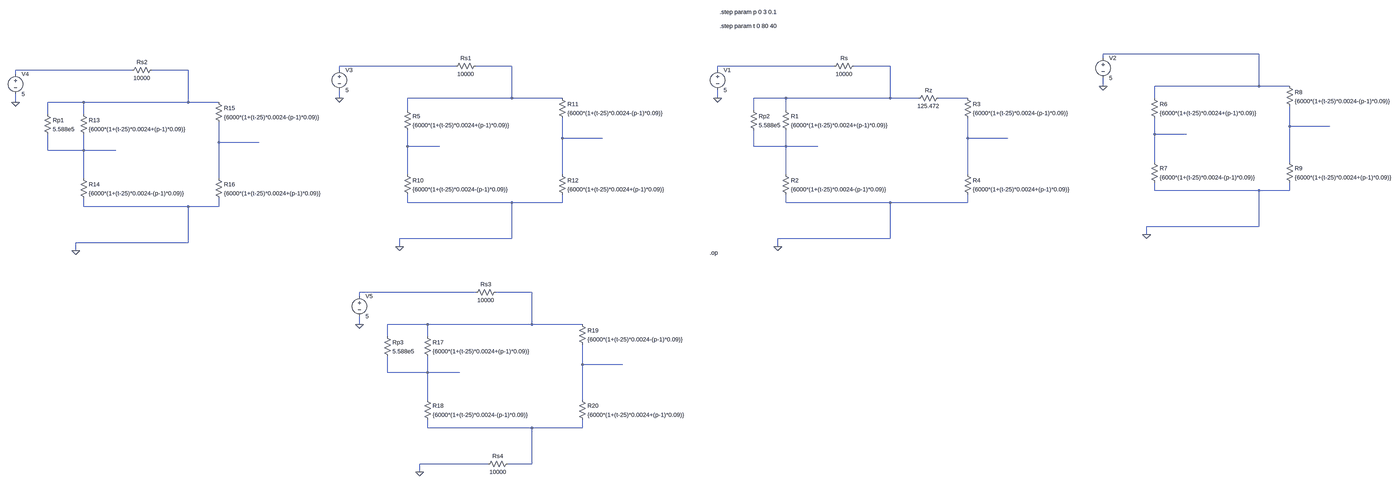
[diagram p0: schematic sims.asc, whole sheet]
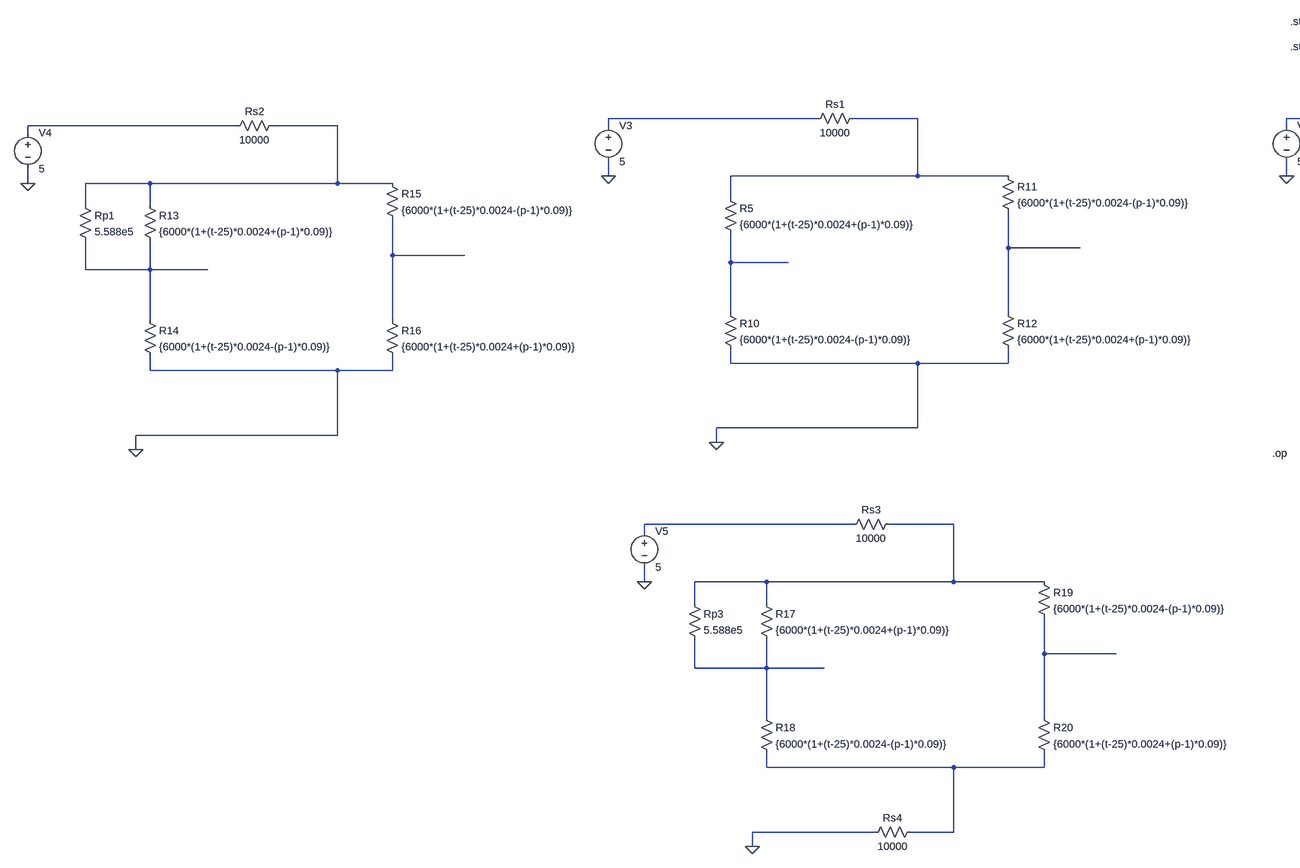
[diagram p1: schematic sims.asc, part, row 1 of 1, column 1 of 2]
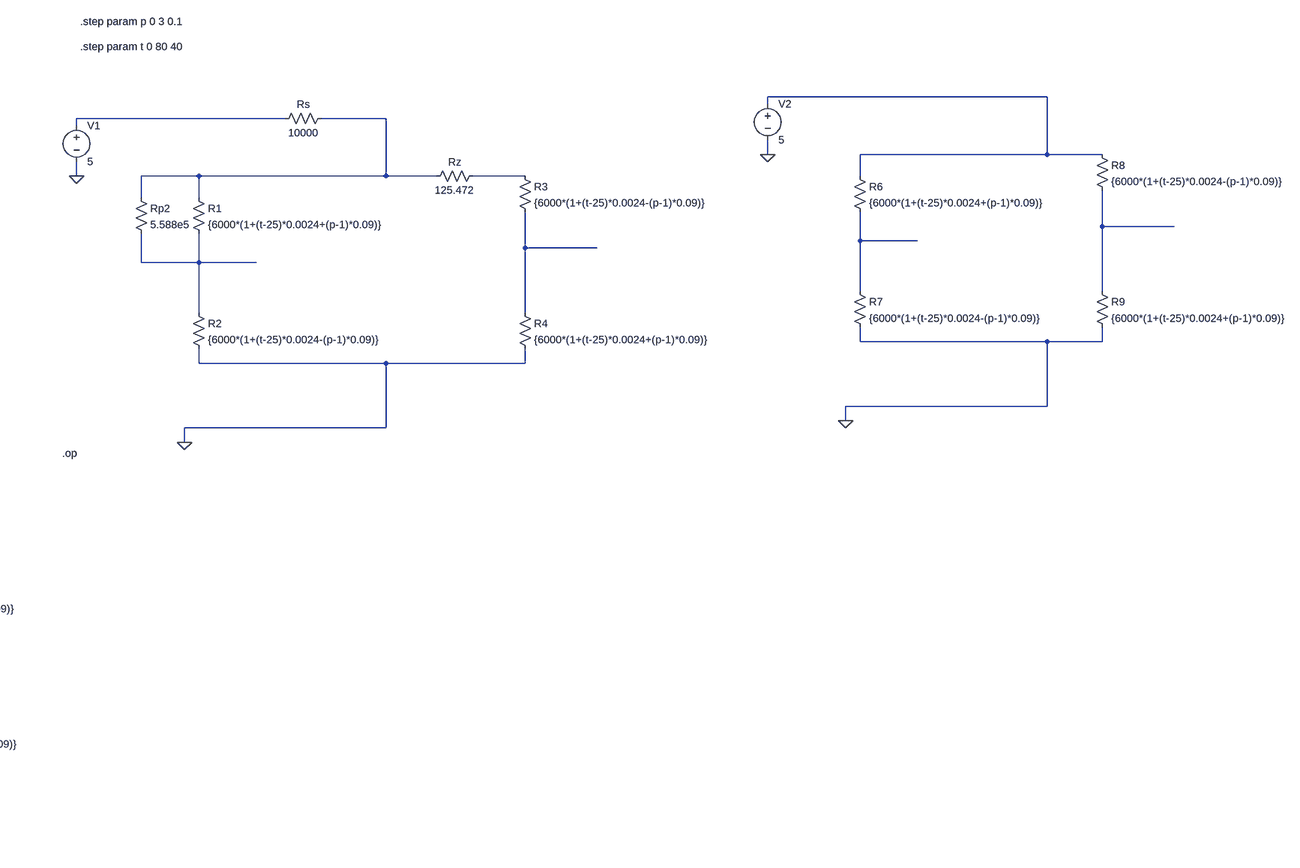
[diagram p2: schematic sims.asc, part, row 1 of 1, column 2 of 2]
sims.asc, the LTspice schematic file:
Version 4
SHEET 1 3096 1620
WIRE 2112 -160 1424 -160
WIRE 1424 -144 1424 -160
WIRE -1920 -112 -2384 -112
WIRE -1696 -112 -1840 -112
WIRE 48 -112 -416 -112
WIRE 272 -112 128 -112
WIRE -3584 -96 -4048 -96
WIRE -3360 -96 -3504 -96
WIRE -2384 -96 -2384 -112
WIRE -416 -96 -416 -112
WIRE -4048 -80 -4048 -96
WIRE 1424 -32 1424 -64
WIRE 2112 -32 2112 -160
WIRE 2112 -32 1696 -32
WIRE 2608 -32 2112 -32
WIRE -2384 16 -2384 -16
WIRE -1696 16 -1696 -112
WIRE -1696 16 -2112 16
WIRE -1200 16 -1696 16
WIRE -416 16 -416 -16
WIRE -144 16 -272 16
WIRE 272 16 272 -112
WIRE 272 16 -144 16
WIRE 448 16 272 16
WIRE 768 16 528 16
WIRE 1696 16 1696 -32
WIRE -4048 32 -4048 0
WIRE -3776 32 -3920 32
WIRE -3360 32 -3360 -96
WIRE -3360 32 -3776 32
WIRE -2864 32 -3360 32
WIRE -2112 64 -2112 16
WIRE -272 64 -272 16
WIRE -144 64 -144 16
WIRE -3920 80 -3920 32
WIRE -3776 80 -3776 32
WIRE 2608 128 2608 48
WIRE 2768 128 2608 128
WIRE 1696 160 1696 96
WIRE 1824 160 1696 160
WIRE -1200 176 -1200 96
WIRE -1040 176 -1200 176
WIRE 768 176 768 96
WIRE 928 176 768 176
WIRE -2864 192 -2864 112
WIRE -2704 192 -2864 192
WIRE -2112 208 -2112 144
WIRE -1984 208 -2112 208
WIRE -272 208 -272 144
WIRE -144 208 -144 144
WIRE -144 208 -272 208
WIRE -16 208 -144 208
WIRE -3920 224 -3920 160
WIRE -3776 224 -3776 160
WIRE -3776 224 -3920 224
WIRE -3648 224 -3776 224
WIRE 1696 272 1696 160
WIRE 2608 272 2608 128
WIRE -2112 320 -2112 208
WIRE -1200 320 -1200 176
WIRE -144 320 -144 208
WIRE 768 320 768 176
WIRE -3776 336 -3776 224
WIRE -2864 336 -2864 192
WIRE 1696 384 1696 352
WIRE 2112 384 1696 384
WIRE 2608 384 2608 352
WIRE 2608 384 2112 384
WIRE -2112 432 -2112 400
WIRE -1696 432 -2112 432
WIRE -1200 432 -1200 400
WIRE -1200 432 -1696 432
WIRE -144 432 -144 400
WIRE 272 432 -144 432
WIRE 768 432 768 400
WIRE 768 432 272 432
WIRE -3776 448 -3776 416
WIRE -3360 448 -3776 448
WIRE -2864 448 -2864 416
WIRE -2864 448 -3360 448
WIRE 2112 528 2112 384
WIRE 2112 528 1664 528
WIRE 1664 560 1664 528
WIRE -1696 576 -1696 432
WIRE -1696 576 -2144 576
WIRE 272 576 272 432
WIRE 272 576 -176 576
WIRE -3360 592 -3360 448
WIRE -3360 592 -3808 592
WIRE -2144 608 -2144 576
WIRE -176 608 -176 576
WIRE -3808 624 -3808 592
WIRE -1840 880 -2304 880
WIRE -1616 880 -1760 880
WIRE -2304 896 -2304 880
WIRE -2304 1008 -2304 976
WIRE -2032 1008 -2192 1008
WIRE -1616 1008 -1616 880
WIRE -1616 1008 -2032 1008
WIRE -1120 1008 -1616 1008
WIRE -2192 1056 -2192 1008
WIRE -2032 1056 -2032 1008
WIRE -1120 1168 -1120 1088
WIRE -960 1168 -1120 1168
WIRE -2192 1200 -2192 1136
WIRE -2032 1200 -2032 1136
WIRE -2032 1200 -2192 1200
WIRE -1904 1200 -2032 1200
WIRE -2032 1312 -2032 1200
WIRE -1120 1312 -1120 1168
WIRE -2032 1424 -2032 1392
WIRE -1616 1424 -2032 1424
WIRE -1120 1424 -1120 1392
WIRE -1120 1424 -1616 1424
WIRE -1792 1568 -2064 1568
WIRE -1616 1568 -1616 1424
WIRE -1616 1568 -1712 1568
WIRE -2064 1600 -2064 1568
FLAG -176 608 0
FLAG -416 16 0
FLAG 1664 560 0
FLAG 1424 -32 0
FLAG -2144 608 0
FLAG -2384 16 0
FLAG -3808 624 0
FLAG -4048 32 0
FLAG -2064 1600 0
FLAG -2304 1008 0
SYMBOL res -160 48 R0
SYMATTR InstName R1
SYMATTR Value {6000*(1+(t-25)*0.0024+(p-1)*0.09)}
SYMBOL res -160 304 R0
SYMATTR InstName R2
SYMATTR Value {6000*(1+(t-25)*0.0024-(p-1)*0.09)}
SYMBOL res 752 0 R0
SYMATTR InstName R3
SYMATTR Value {6000*(1+(t-25)*0.0024-(p-1)*0.09)}
SYMBOL res 752 304 R0
SYMATTR InstName R4
SYMATTR Value {6000*(1+(t-25)*0.0024+(p-1)*0.09)}
SYMBOL res 144 -128 R90
WINDOW 0 0 56 VBottom 2
WINDOW 3 32 56 VTop 2
SYMATTR InstName Rs
SYMATTR Value 10000
SYMBOL voltage -416 -112 R0
WINDOW 123 0 0 Left 0
WINDOW 39 0 0 Left 0
SYMATTR InstName V1
SYMATTR Value 5
SYMBOL res 1680 0 R0
SYMATTR InstName R6
SYMATTR Value {6000*(1+(t-25)*0.0024+(p-1)*0.09)}
SYMBOL res 1680 256 R0
SYMATTR InstName R7
SYMATTR Value {6000*(1+(t-25)*0.0024-(p-1)*0.09)}
SYMBOL res 2592 -48 R0
SYMATTR InstName R8
SYMATTR Value {6000*(1+(t-25)*0.0024-(p-1)*0.09)}
SYMBOL res 2592 256 R0
SYMATTR InstName R9
SYMATTR Value {6000*(1+(t-25)*0.0024+(p-1)*0.09)}
SYMBOL voltage 1424 -160 R0
WINDOW 123 0 0 Left 0
WINDOW 39 0 0 Left 0
SYMATTR InstName V2
SYMATTR Value 5
SYMBOL res 544 0 R90
WINDOW 0 0 56 VBottom 2
WINDOW 3 32 56 VTop 2
SYMATTR InstName Rz
SYMATTR Value 125.472
SYMBOL res -288 48 R0
SYMATTR InstName Rp2
SYMATTR Value 5.588e5
SYMBOL res -2128 48 R0
SYMATTR InstName R5
SYMATTR Value {6000*(1+(t-25)*0.0024+(p-1)*0.09)}
SYMBOL res -2128 304 R0
SYMATTR InstName R10
SYMATTR Value {6000*(1+(t-25)*0.0024-(p-1)*0.09)}
SYMBOL res -1216 0 R0
SYMATTR InstName R11
SYMATTR Value {6000*(1+(t-25)*0.0024-(p-1)*0.09)}
SYMBOL res -1216 304 R0
SYMATTR InstName R12
SYMATTR Value {6000*(1+(t-25)*0.0024+(p-1)*0.09)}
SYMBOL res -1824 -128 R90
WINDOW 0 0 56 VBottom 2
WINDOW 3 32 56 VTop 2
SYMATTR InstName Rs1
SYMATTR Value 10000
SYMBOL voltage -2384 -112 R0
WINDOW 123 0 0 Left 0
WINDOW 39 0 0 Left 0
SYMATTR InstName V3
SYMATTR Value 5
SYMBOL res -3792 64 R0
SYMATTR InstName R13
SYMATTR Value {6000*(1+(t-25)*0.0024+(p-1)*0.09)}
SYMBOL res -3792 320 R0
SYMATTR InstName R14
SYMATTR Value {6000*(1+(t-25)*0.0024-(p-1)*0.09)}
SYMBOL res -2880 16 R0
SYMATTR InstName R15
SYMATTR Value {6000*(1+(t-25)*0.0024-(p-1)*0.09)}
SYMBOL res -2880 320 R0
SYMATTR InstName R16
SYMATTR Value {6000*(1+(t-25)*0.0024+(p-1)*0.09)}
SYMBOL res -3488 -112 R90
WINDOW 0 0 56 VBottom 2
WINDOW 3 32 56 VTop 2
SYMATTR InstName Rs2
SYMATTR Value 10000
SYMBOL voltage -4048 -96 R0
WINDOW 123 0 0 Left 0
WINDOW 39 0 0 Left 0
SYMATTR InstName V4
SYMATTR Value 5
SYMBOL res -3936 64 R0
SYMATTR InstName Rp1
SYMATTR Value 5.588e5
SYMBOL res -2048 1040 R0
SYMATTR InstName R17
SYMATTR Value {6000*(1+(t-25)*0.0024+(p-1)*0.09)}
SYMBOL res -2048 1296 R0
SYMATTR InstName R18
SYMATTR Value {6000*(1+(t-25)*0.0024-(p-1)*0.09)}
SYMBOL res -1136 992 R0
SYMATTR InstName R19
SYMATTR Value {6000*(1+(t-25)*0.0024-(p-1)*0.09)}
SYMBOL res -1136 1296 R0
SYMATTR InstName R20
SYMATTR Value {6000*(1+(t-25)*0.0024+(p-1)*0.09)}
SYMBOL res -1744 864 R90
WINDOW 0 0 56 VBottom 2
WINDOW 3 32 56 VTop 2
SYMATTR InstName Rs3
SYMATTR Value 10000
SYMBOL res -1696 1552 R90
WINDOW 0 0 56 VBottom 2
WINDOW 3 32 56 VTop 2
SYMATTR InstName Rs4
SYMATTR Value 10000
SYMBOL voltage -2304 880 R0
WINDOW 123 0 0 Left 0
WINDOW 39 0 0 Left 0
SYMATTR InstName V5
SYMATTR Value 5
SYMBOL res -2208 1040 R0
SYMATTR InstName Rp3
SYMATTR Value 5.588e5
TEXT -408 -328 Left 2 !.step param p 0 3 0.1
TEXT -408 -272 Left 2 !.step param t 0 80 40
TEXT -448 632 Left 2 !.op

The netlist it stands for:
* sims.asc
R1 N005 N015 {6000*(1+(t-25)*0.0024+(p-1)*0.09)}
R2 N015 0 {6000*(1+(t-25)*0.0024-(p-1)*0.09)}
R3 N008 N012 {6000*(1+(t-25)*0.0024-(p-1)*0.09)}
R4 N012 0 {6000*(1+(t-25)*0.0024+(p-1)*0.09)}
Rs N005 N004 10000
V1 N004 0 5
R6 N001 N010 {6000*(1+(t-25)*0.0024+(p-1)*0.09)}
R7 N010 0 {6000*(1+(t-25)*0.0024-(p-1)*0.09)}
R8 N001 N009 {6000*(1+(t-25)*0.0024-(p-1)*0.09)}
R9 N009 0 {6000*(1+(t-25)*0.0024+(p-1)*0.09)}
V2 N001 0 5
Rz N008 N005 125.472
Rp2 N005 N015 5.588e5
R5 N003 N014 {6000*(1+(t-25)*0.0024+(p-1)*0.09)}
R10 N014 0 {6000*(1+(t-25)*0.0024-(p-1)*0.09)}
R11 N003 N011 {6000*(1+(t-25)*0.0024-(p-1)*0.09)}
R12 N011 0 {6000*(1+(t-25)*0.0024+(p-1)*0.09)}
Rs1 N003 N002 10000
V3 N002 0 5
R13 N007 N016 {6000*(1+(t-25)*0.0024+(p-1)*0.09)}
R14 N016 0 {6000*(1+(t-25)*0.0024-(p-1)*0.09)}
R15 N007 N013 {6000*(1+(t-25)*0.0024-(p-1)*0.09)}
R16 N013 0 {6000*(1+(t-25)*0.0024+(p-1)*0.09)}
Rs2 N007 N006 10000
V4 N006 0 5
Rp1 N007 N016 5.588e5
R17 N018 N020 {6000*(1+(t-25)*0.0024+(p-1)*0.09)}
R18 N020 N021 {6000*(1+(t-25)*0.0024-(p-1)*0.09)}
R19 N018 N019 {6000*(1+(t-25)*0.0024-(p-1)*0.09)}
R20 N019 N021 {6000*(1+(t-25)*0.0024+(p-1)*0.09)}
Rs3 N018 N017 10000
Rs4 N021 0 10000
V5 N017 0 5
Rp3 N018 N020 5.588e5
.step param p 0 3 0.1
.step param t 0 80 40
.op
.backanno
.end